# EAGLE design naswietlarka (EAGLE 6.4)
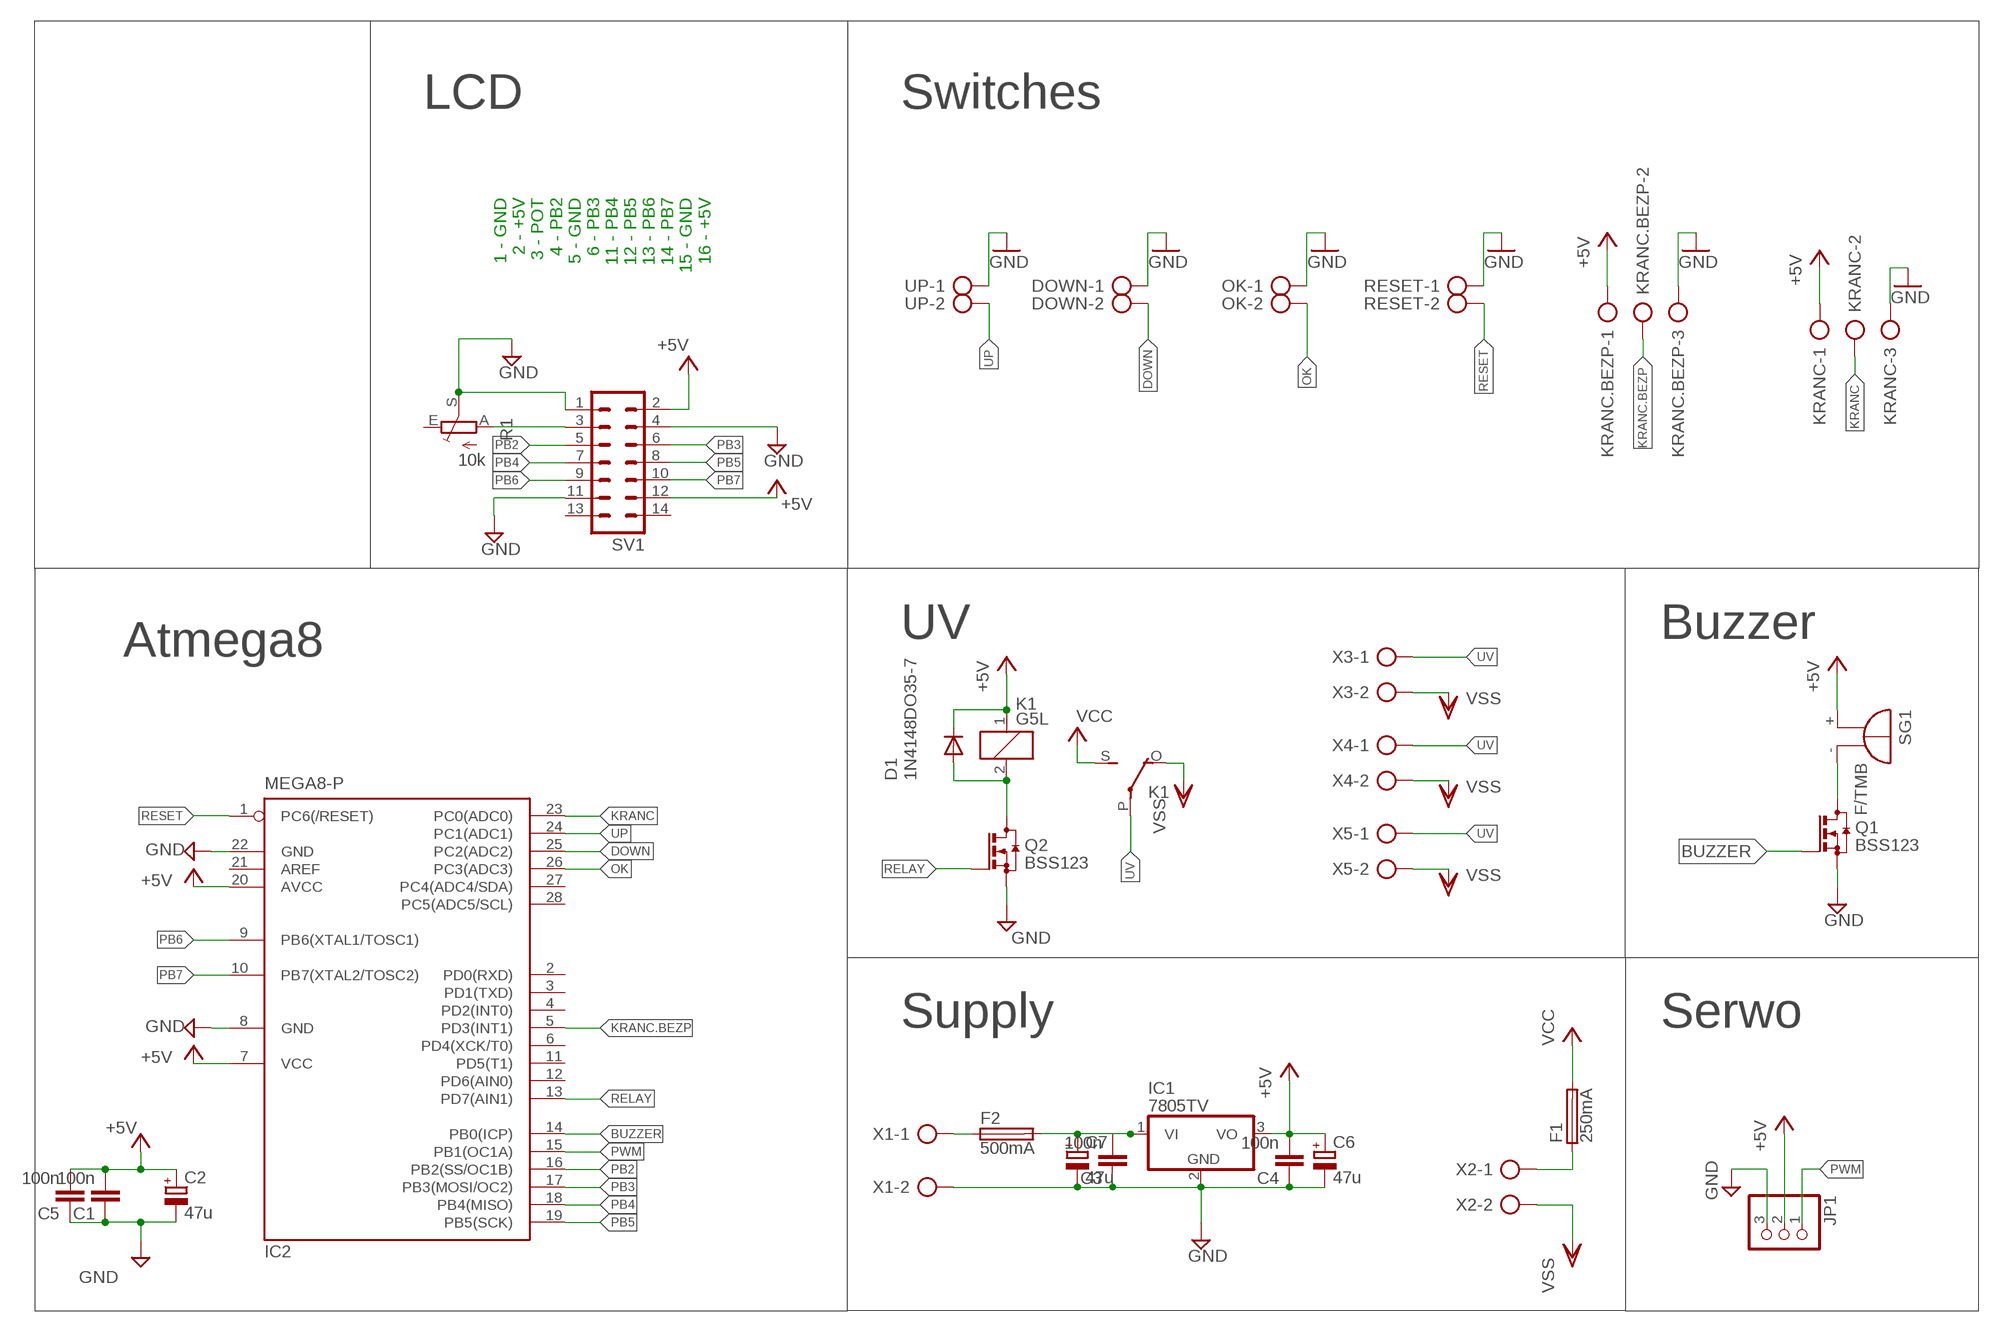
[diagram p0: schematic, sheet 1]

## Parts
C1  100n  C-EUC0805  [C0805]
C2  47u  CPOL-EUE2.5-5  [E2,5-5]
C3  100n  C-EUC0805  [C0805]
C4  100n  C-EUC0805  [C0805]
C5  100n  C-EUC0805  [C0805]
C6  47u  CPOL-EUE2.5-5  [E2,5-5]
C7  47u  CPOL-EUE2.5-5  [E2,5-5]
D1  1N4148DO35-7  [DO35-7]
DOWN  AK300/2  [AK300/2]
F1  250mA  SH22,5  [SH22,5]
F2  500mA  SH22,5  [SH22,5]
IC1  7805TV  [TO220V]
IC2  MEGA8-P  [DIL28-3]
JP1  PINHD-1X3  [1X03]
K1  G5L  [G5LE]
KRANC  AK300/3  [AK300/3]
KRANC.BEZP  AK300/3  [AK300/3]
OK  AK300/2  [AK300/2]
Q1  BSS123  [SOT23]
Q2  BSS123  [SOT23]
R1  10k  TRIM_EU-CA6V  [CA6V]
RESET  AK300/2  [AK300/2]
SG1  F/TMB  [F/TMB]
SV1  ML14  [ML14]
UP  AK300/2  [AK300/2]
X1  AK500/2-H  [AK500/2-H]
X2  AK500/2-H  [AK500/2-H]
X3  AK500/2-H  [AK500/2-H]
X4  AK500/2-H  [AK500/2-H]
X5  AK500/2-H  [AK500/2-H]

## Nets
+5V: C1.2 C2.+ C4.2 C5.2 C6.+ D1.C IC1.3(VO) IC2.7(VCC) IC2.20(AVCC) JP1.2 K1.1 KRANC.1 KRANC.BEZP.1 SG1.+ SV1.2 SV1.12
BUZZER: IC2.14(PB0(ICP)) Q1.1(G)
DOWN: DOWN.2 IC2.25(PC2(ADC2))
GND: C1.1 C2.- C3.1 C4.1 C5.1 C6.- C7.- DOWN.1 IC1.2(GND) IC2.8(GND) IC2.22(GND) JP1.3 KRANC.3 KRANC.BEZP.3 OK.1 Q1.2(S) Q2.2(S) R1.S RESET.1 SV1.1 SV1.4 SV1.11 UP.1 X1.2
KRANC: IC2.23(PC0(ADC0)) KRANC.2
KRANC.BEZP: IC2.5(PD3(INT1)) KRANC.BEZP.2
N$1: R1.A SV1.3
N$2: D1.A K1.2 Q2.3(D)
N$3: F1.1 X2.1
N$4: Q1.3(D) SG1.-
N$5: F2.1 X1.1
N$6: C3.2 C7.+ F2.2 IC1.1(VI)
OK: IC2.26(PC3(ADC3)) OK.2
PB2: IC2.16(PB2(SS/OC1B)) SV1.5
PB3: IC2.17(PB3(MOSI/OC2)) SV1.6
PB4: IC2.18(PB4(MISO)) SV1.7
PB5: IC2.19(PB5(SCK)) SV1.8
PB6: IC2.9(PB6(XTAL1/TOSC1)) SV1.9
PB7: IC2.10(PB7(XTAL2/TOSC2)) SV1.10
PWM: IC2.15(PB1(OC1A)) JP1.1
RELAY: IC2.13(PD7(AIN1)) Q2.1(G)
RESET: IC2.1(PC6(/RESET)) RESET.2
UP: IC2.24(PC1(ADC1)) UP.2
UV: K1.P(2:P) X3.1 X4.1 X5.1
VCC: F1.2 K1.S(2:S)
VSS: K1.O(2:O) X2.2 X3.2 X4.2 X5.2
Unconnected: IC2.2(PD0(RXD)) IC2.3(PD1(TXD)) IC2.4(PD2(INT0)) IC2.6(PD4(XCK/T0)) IC2.11(PD5(T1)) IC2.12(PD6(AIN0)) IC2.21(AREF) IC2.27(PC4(ADC4/SDA)) IC2.28(PC5(ADC5/SCL)) R1.E SV1.13 SV1.14

## Notes on the sheet
- LCD | Switches
- 1 - GND
  2 - +5V
  3 - POT
  4 - PB2
  5 - GND
  6 - PB3
  11 - PB4
  12 - PB5
  13 - PB6
  14 - PB7
  15 - GND
  16 - +5V
- UV | Buzzer
- Atmega8
- Supply | Serwo

## Library data of the parts
C1 C3-C5 = rcl:C-EU: CAPACITOR, European symbol
C2 C6 C7 = rcl:CPOL-EU: POLARIZED CAPACITOR, European symbol
D1 = diode:1N4148: DIODE high speed (Philips)
DOWN OK RESET UP = con-ptr500:AK300/2: CONNECTOR; OC_FARNELL: unknown; OC_NEWARK: unknown
F1 F2 = fuse:SH22,5: FUSE HOLDER grid 22,5 mm, OGN0031 8201, Schurter (Buerklin); MF: SCHURTER; MPN: 0031.8201; OC_FARNELL: 1162740; OC_NEWARK: 96F8317
IC1 = linear:78*: Positive VOLTAGE REGULATOR Source: http://cache.national.com/ds/LM/LM78L05.pdf http://www.fairchildsemi.com/ds/LM/LM7805.pdf
IC2 = atmel:MEGA8-P: MICROCONTROLLER 8 Kbytes FLASH, 1 kbytes SRAM, 512 bytes EEPROM, USART, 4-channel 10 bit ADC, 2-channel 8 bit ADC Pin compatible with Atmega48, ATMega88, ATMega168 Source: avr.lbr; OC_FARNELL: unknown; OC_NEWARK: unknown
JP1 = pinhead:PINHD-1X3: PIN HEADER
K1 = relay:G5L: RELAY 1 x switch, 10 A/120 V AC, 8 A/30 V ADC, Omron; OC_FARNELL: unknown; OC_NEWARK: unknown
KRANC KRANC.BEZP = con-ptr500:AK300/3: CONNECTOR; OC_FARNELL: unknown; OC_NEWARK: unknown
Q1 Q2 = transistor-small-signal:BSS123: N-CHANNEL MOS FET
R1 = pot:TRIM_EU-: POTENTIOMETER
SG1 = buzzer:F/TMB: BUZZER Source: Buerklin; OC_FARNELL: unknown; OC_NEWARK: unknown
SV1 = con-harting-ml:ML14: HARTING; OC_FARNELL: unknown; OC_NEWARK: unknown
X1-X5 = con-ptr500:AK500/2-H: CONNECTOR Aug. 2004 / PTR Meßtechnik: Die Bezeichnung der Serie AK505 wurde geändert. Es handelt sich hierbei um AK500 in horizontaler Ausführung.; OC_FARNELL: unknown; OC_NEWARK: unknown

## Board
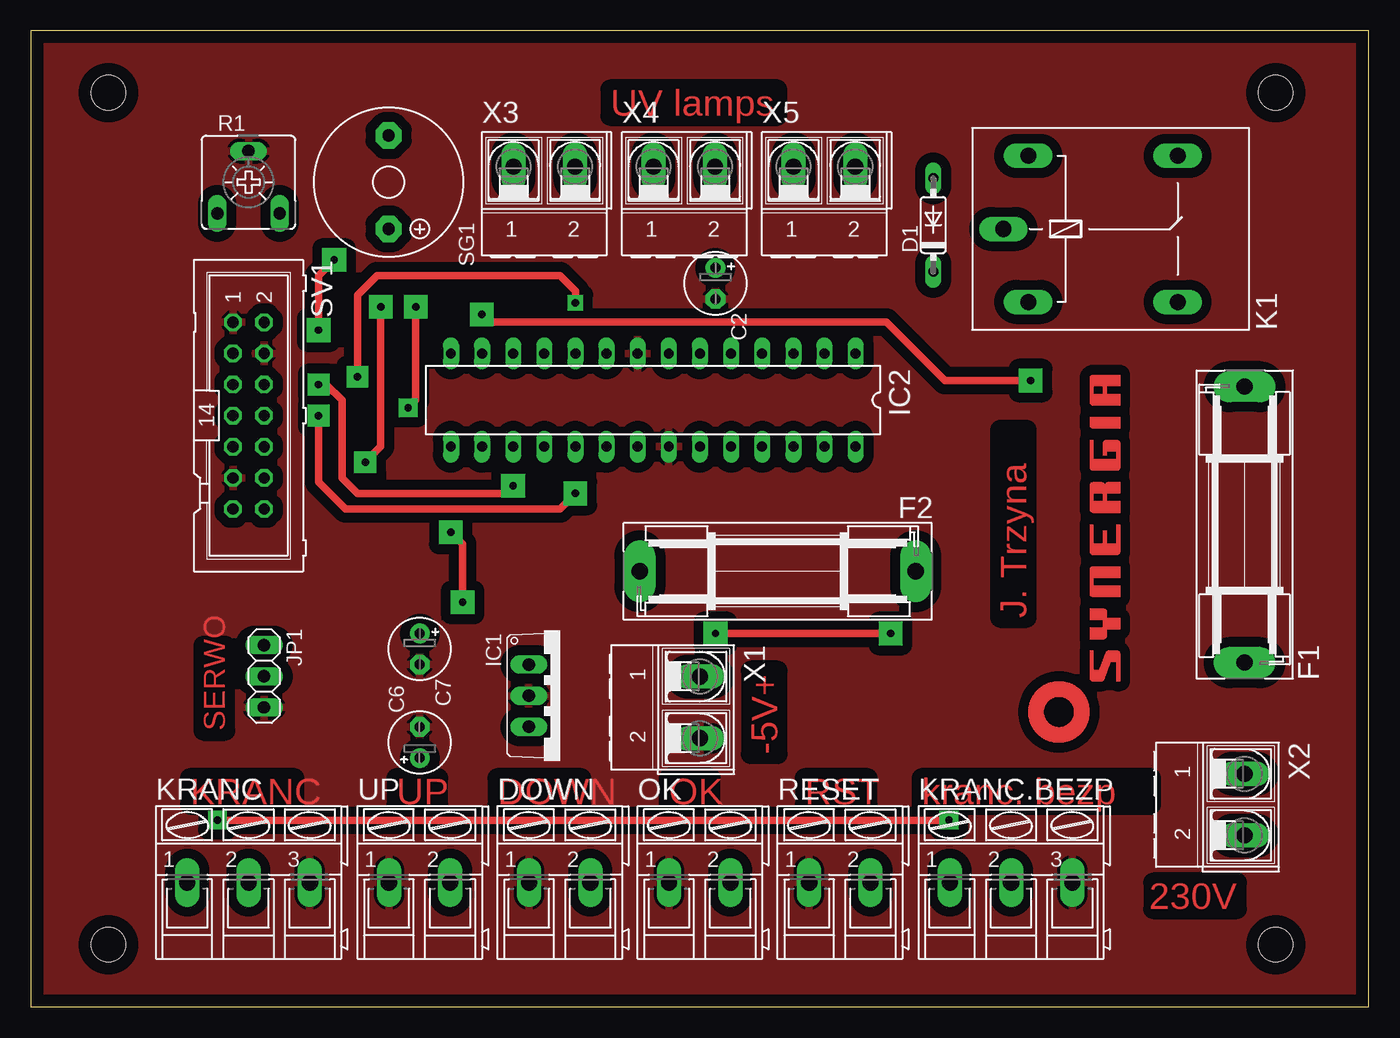
[diagram p1: board, top side]
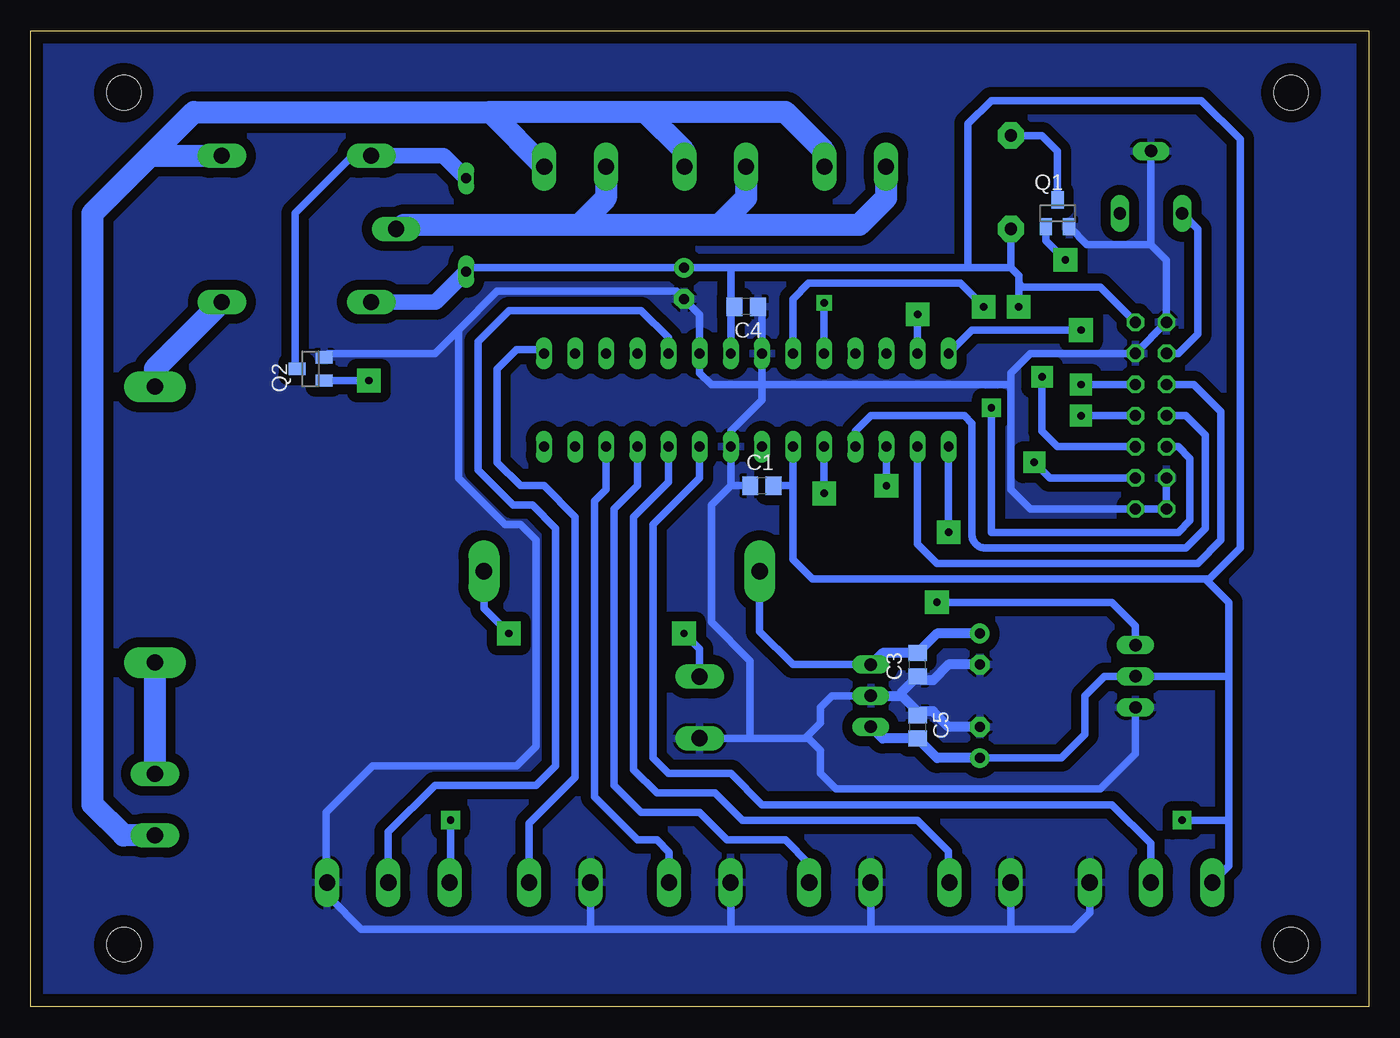
[diagram p2: board, bottom side, seen from below]

Size 109.2 x 79.68 mm. Coordinates in mm from the lower left corner, seen from the top.
Outline: 0,0 109.2,0 109.2,79.68 0,79.68 0,0
Copper layers (1*16): Top 0.035mm / dielectric 1.5mm / Bottom 0.035mm
Design rules "default": minimum track width 10mil, minimum drill 24mil, track to track 8mil, track to pad 8mil, pad to pad 8mil, via to via 8mil, smd to smd 8mil, copper to edge 40mil, drill to drill 8mil, minimum pad ring 10mil, minimum via ring 8mil, stop-mask expansion 4mil, vias tented up to drill 0mil, thermal gap 10mil
Holes 2.8 mm at 6.35,74.61 101.6,74.61 101.6,5.08 6.35,5.08

### Footprints (pad centres in the part's own frame; a part is rotated, then mirrored left to right if it is on the bottom)
C0805 = smd 1.3 x 1.5: 1 -0.95,0; 2 0.95,0
E2,5-5 = drill 0.813 pad 1.6: + -1.27,0 | drill 0.813 pad 1.6 octagon: - 1.27,0
DO35-7 = drill 0.813 long: A 3.81,0; C -3.81,0
AK300/2 = drill 1.321 long: 1 -2.515,0; 2 2.489,0
SH22,5 = drill 1.321 pad 2.54 long: 1 -11.252,0; 2 11.252,0
TO220V = drill 1.016 long: 1 -2.54,-2.54; 2 0,-2.54; 3 2.54,-2.54
DIL28-3 = drill 0.813 long: 1 -16.51,-3.81; 2 -13.97,-3.81; 3 -11.43,-3.81; 4 -8.89,-3.81; 5 -6.35,-3.81; 6 -3.81,-3.81; 7 -1.27,-3.81; 8 1.27,-3.81; 9 3.81,-3.81; 10 6.35,-3.81; 11 8.89,-3.81; 12 11.43,-3.81; 13 13.97,-3.81; 14 16.51,-3.81; 15 16.51,3.81; 16 13.97,3.81; 17 11.43,3.81; 18 8.89,3.81; 19 6.35,3.81; 20 3.81,3.81; 21 1.27,3.81; 22 -1.27,3.81; 23 -3.81,3.81; 24 -6.35,3.81; 25 -8.89,3.81; 26 -11.43,3.81; 27 -13.97,3.81; 28 -16.51,3.81
1X03 = drill 1.016 long: 1 -2.54,0; 2 0,0; 3 2.54,0
G5LE = drill 1.321 long: 1 -7.493,-5.969; 2 -7.493,5.969; O 4.699,5.969; P -9.525,0; S 4.699,-5.969
AK300/3 = drill 1.321 long: 1 -5.004,0; 2 0,0; 3 5.004,0
SOT23 = smd 1 x 1.4: 1 -0.95,-1.1; 2 0.95,-1.1; 3 0,1.1
CA6V = drill 1.016 long: A -2.54,-2.54; E 2.54,-2.54; S 0,2.54
F/TMB = drill 1.016 pad 2.159 octagon: + 3.81,0; - -3.81,0
ML14 = drill 0.914 octagon: 1 -7.62,-1.27; 2 -7.62,1.27; 3 -5.08,-1.27; 4 -5.08,1.27; 5 -2.54,-1.27; 6 -2.54,1.27; 7 0,-1.27; 8 0,1.27; 9 2.54,-1.27; 10 2.54,1.27; 11 5.08,-1.27; 12 5.08,1.27; 13 7.62,-1.27; 14 7.62,1.27
AK500/2-H = drill 1.321 long: 1 -2.515,0; 2 2.515,0

### Placement (x,y rotation side)
C1  49.53,42.54 0 bottom
C2  55.88,59.05 270 top
C3  36.83,27.94 90 bottom
C4  50.8,57.15 180 bottom
C5  36.83,22.86 270 bottom
C6  31.75,21.59 90 top
C7  31.75,29.21 270 top
D1  73.66,63.82 90 top
DOWN  43.18,10.16 0 top
F1  99.06,39.37 90 top
F2  60.96,35.56 180 top
IC1  43.18,25.4 270 top
IC2  50.8,49.53 180 top
JP1  19.05,26.99 270 top
K1  88.9,63.5 0 top
KRANC  17.78,10.16 0 top
KRANC.BEZP  80.01,10.16 0 top
OK  54.61,10.16 0 top
Q1  25.4,64.77 0 bottom
Q2  86.36,52.07 90 bottom
R1  17.78,67.31 0 top
RESET  66.04,10.16 0 top
SG1  29.21,67.31 270 top
SV1  17.78,48.26 270 top
U$1  [SYNERGIA_30MM]  88.9,21.59 90 top
UP  31.75,10.16 0 top
X1  54.61,24.45 270 top
X2  99.06,16.51 270 top
X3  41.91,68.58 0 top
X4  53.34,68.58 0 top
X5  64.77,68.58 0 top

### Tracks (layer width: path | path; a pad name or v marks a point on that pad's centre or on a via)
+5V  (via drill 0.6 pad 1.52, 0.6 pad 1.78, 0.6 pad 1.93)
  Top 0.61: v74.93,15.24 v15.24,15.24 | v28.57,57.15 28.57,45.72 v27.3,44.45
  Bottom 0.61: IC2.7 52.07,57.15 | 52.07,57.15 52.07,60.33 | 32.7,60.33 52.07,60.33 | SV1.12 26.04,43.18 v27.3,44.45 | C6.+ 25.08,20.32 23.18,22.23 23.18,25.4 21.59,26.99 JP1.2 11.43,26.99 | 46.99,42.54 46.99,36.51 45.4,34.92 13.34,34.92 | 46.99,42.54 IC2.20 | C4.2 52.07,57.15 | C1.2 46.99,42.54 | SG1.+ 29.21,60.33 | KRANC.1 11.43,11.51 11.43,15.24 | KRANC.BEZP.1 74.93,10.16 v74.93,15.24 | v15.24,15.24 11.43,15.24 | 13.34,34.92 13.02,34.92 10.48,37.46 10.48,70.8 13.65,73.98 30.8,73.98 32.7,72.07 32.7,60.33 | 11.43,15.24 11.43,26.99 | 11.43,26.99 11.43,33.02 13.34,34.92 | 32.7,60.33 29.21,60.33 | 29.21,60.33 28.57,59.69 28.57,59.05 | 28.57,59.05 v28.57,57.15 | SV1.2 21.91,58.74 28.26,58.74 28.57,59.05 | 52.07,60.33 C2.+ 73.34,60.33 arc-90 D1.C
  Bottom 0.813: C6.+ 35.24,20.32 C5.2 39.69,21.91 IC1.3
  Bottom 1.27: D1.C 76.14,57.53 K1.1
BUZZER  (via drill 0.6 pad 1.93)
  Top 0.61: v24.77,60.96 23.49,59.69 v23.49,55.24
  Bottom 0.61: IC2.14 32.38,55.24 v23.49,55.24 | Q1.1 26.35,62.55 v24.77,60.96
DOWN
  Bottom 0.61: IC2.25 59.69,42.54 61.59,40.64 61.59,18.1 59.37,15.87 54.61,15.87 52.39,13.65 47.62,13.65 45.67,11.7 DOWN.2
GND
  Bottom 0.61: 29.21,50.8 49.53,50.8 | 49.53,50.8 IC2.8 49.53,56.83 C4.1 | SV1.11 16.51,40.64 27.62,40.64 29.21,42.23 29.21,50.8 | C1.1 52.07,42.55 | 52.07,42.55 IC2.22 52.07,46.99 49.53,49.53 49.53,50.8 | R1.S 17.78,62.23 | 17.78,62.23 16.51,60.96 SV1.1 SV1.4 27.62,53.34 29.21,51.75 29.21,50.8 | Q1.2 23.01,62.23 17.78,62.23 | DOWN.1 40.64,10.13 40.64,6.35 | 40.64,6.35 29.21,6.35 | 29.21,6.35 24.13,6.35 22.78,7.7 KRANC.3 | 63.5,6.35 82.23,6.35 84.77,8.89 84.77,9.92 KRANC.BEZP.3 85.01,11.35 85.09,11.43 85.09,15.87 81.28,19.69 69.53,19.69 67.95,21.27 67.95,38.1 69.22,39.37 70.48,39.37 74.3,43.18 74.3,55.24 | 63.5,6.35 52.07,6.35 | 52.07,6.35 40.64,6.35 | RESET.1 63.5,10.13 63.5,6.35 | OK.1 52.07,10.13 52.07,6.35 | UP.1 29.21,10.13 29.21,6.35 | 74.3,55.24 71.12,58.42 56.52,58.42 C2.- 54.61,56.52 54.61,51.75 53.66,50.8 49.53,50.8 | 74.3,55.24 76.2,53.34 84.94,53.34 Q2.2 | 52.07,42.55 52.07,42.54 53.66,40.96 53.66,31.43 50.48,28.26 50.48,21.93 | JP1.3 19.05,20.64 21.91,17.78 43.5,17.78 44.77,19.05 44.77,20.96 45.74,21.93 46.01,21.93 | X1.2 50.48,21.93 | 50.48,21.93 46.01,21.93 | IC1.2 43.81,25.4 44.77,24.45 44.77,23.18 46.01,21.93
  Bottom 0.813: IC1.2 38.1,25.4 | 38.1,25.4 38.1,25.72 C3.1 36.51,26.67 35.56,26.67 34.29,27.94 C7.- | 38.1,25.4 36.83,24.13 C5.1 36.51,24.13 35.56,24.13 34.29,22.86 C6.-
  pour Top (isolate 0.813): -1.27,80.01 111.76,80.01 111.76,-2.54 -1.27,-2.54
  pour Bottom (isolate 0.813): -1.27,80.01 111.76,80.01 111.76,-2.54 -1.27,-2.54
KRANC
  Bottom 0.61: IC2.23 54.61,43.18 58.42,39.37 58.42,20.32 57.15,19.05 52.07,19.05 49.53,16.51 20.95,16.51 17.78,13.33 KRANC.2
KRANC.BEZP
  Bottom 0.61: IC2.5 57.15,54.61 59.37,56.83 70.17,56.83 72.71,54.29 72.71,43.81 69.85,40.96 68.26,40.96 66.36,39.05 66.36,19.69 67.95,18.1 76.2,18.1 80.01,14.29 KRANC.BEZP.2
N$1
  Bottom 0.61: SV1.3 15.56,53.34 13.97,54.93 13.97,63.5 R1.A
N$2
  Bottom 0.61: Q2.3 87.63,52.24 87.63,64.77 82.93,69.47 K1.2
  Bottom 1.27: D1.A 75.5,69.47 K1.2
N$3
  Bottom 1.778: F1.1 X2.1
N$4
  Bottom 0.61: Q1.3 25.4,69.85 26.67,71.12 SG1.-
N$5  (via drill 0.6 pad 1.93)
  Top 0.61: v55.88,30.48 v70.17,30.48
  Bottom 0.61: v70.17,30.48 72.21,32.52 F2.1 | v55.88,30.48 54.61,29.21 X1.1
N$6
  Bottom 0.61: F2.2 49.71,30.66 46.99,27.94 IC1.1
  Bottom 0.813: C7.+ 35.24,30.48 C3.2 39.69,28.89 IC1.1
OK
  Bottom 0.61: IC2.26 62.23,42.23 63.18,41.27 63.18,17.14 59.69,13.65 58.1,13.62 57.1,12.62 OK.2
PB2
  Bottom 0.61: SV1.5 14.29,50.8 12.07,48.58 12.07,38.1 13.97,36.2 35.24,36.2 36.83,37.78 IC2.16
PB3  (via drill 0.6 pad 1.78, 0.6 pad 1.93)
  Top 0.61: v23.49,50.8 24.13,50.8 25.4,49.53 25.4,43.18 26.67,41.91 38.73,41.91 v39.37,42.54
  Bottom 0.61: SV1.6 v23.49,50.8 | IC2.17 v39.37,42.54
PB4
  Bottom 0.61: SV1.7 14.92,48.26 13.34,46.67 13.34,39.05 14.92,37.46 31.43,37.46 arc90 32.38,38.73 32.38,47.62 33.02,48.26 40.64,48.26 41.91,46.99 IC2.18
PB5  (via drill 0.6 pad 1.78, 0.6 pad 1.93)
  Top 0.61: v23.49,48.26 23.49,42.86 25.72,40.64 43.18,40.64 v44.45,41.91
  Bottom 0.61: SV1.8 v23.49,48.26 | IC2.19 v44.45,41.91
PB6  (via drill 0.6 pad 1.52, 0.6 pad 1.93)
  Top 0.61: v31.43,57.15 31.43,49.53 v30.8,48.89
  Bottom 0.61: SV1.9 15.56,45.72 14.61,44.77 14.61,39.69 15.56,38.73 30.8,38.73 v30.8,48.89 | v31.43,57.15 33.34,59.05 45.72,59.05 46.99,57.78 IC2.9
PB7  (via drill 0.6 pad 1.27, 0.6 pad 1.78)
  Top 0.61: v26.67,51.43 26.67,58.1 28.26,59.69 43.18,59.69 44.45,58.42 v44.45,57.47
  Bottom 0.61: IC2.10 v44.45,57.47 | v26.67,51.43 26.67,46.99 25.4,45.72 SV1.10
PWM  (via drill 0.6 pad 1.93)
  Top 0.61: v34.29,38.73 35.24,37.78 v35.24,33.02
  Bottom 0.61: IC2.15 v34.29,38.73 | v35.24,33.02 20.95,33.02 19.05,31.11 JP1.1
RELAY  (via drill 0.6 pad 1.93)
  Top 0.61: v81.6,51.12 74.61,51.12 69.85,55.88 37.46,55.88 v36.83,56.52
  Bottom 0.61: IC2.13 v36.83,56.52 | v81.6,51.12 82.23,51.12 Q2.1
RESET
  Bottom 0.61: RESET.2 68.53,14.97 64.77,18.73 64.77,40 67.31,42.54 69.22,42.54 71.12,44.45 71.12,52.07 69.53,53.66 67.63,53.66 IC2.1
UP
  Bottom 0.61: IC2.24 57.15,42.86 60.01,40 60.01,19.37 58.1,17.46 53.34,17.46 51.12,15.24 36.83,15.24 34.29,12.7 34.29,10.21 UP.2
UV
  Bottom 1.778: X3.1 39.39,66.02 41.59,63.82 53.02,63.82 | 53.02,63.82 64.45,63.82 | 64.45,63.82 78.74,63.82 K1.P | X5.1 62.26,66.02 64.45,63.82 | X4.1 50.82,66.02 53.02,63.82
VCC
  Bottom 1.778: K1.S 99.06,52.07 F1.2
VSS
  Bottom 1.778: X2.2 101.62,13.99 104.14,16.51 104.14,64.77 99.44,69.47 | 99.44,69.47 K1.O | 71.73,73.02 95.89,73.02 99.44,69.47 | 71.73,73.02 X5.2 | X4.2 55.85,69.83 59.05,73.02 | 59.05,73.02 71.73,73.02 | X3.2 44.42,69.83 47.62,73.02 59.05,73.02

### Text on the board
Top: UV lamps | J. Trzyna | SERWO | -5V+ | KRANC | UP | DOWN | OK | RST | kranc. bezp | 230V